# EAGLE design AT42QT2120-breakout (EAGLE 9.2.2)
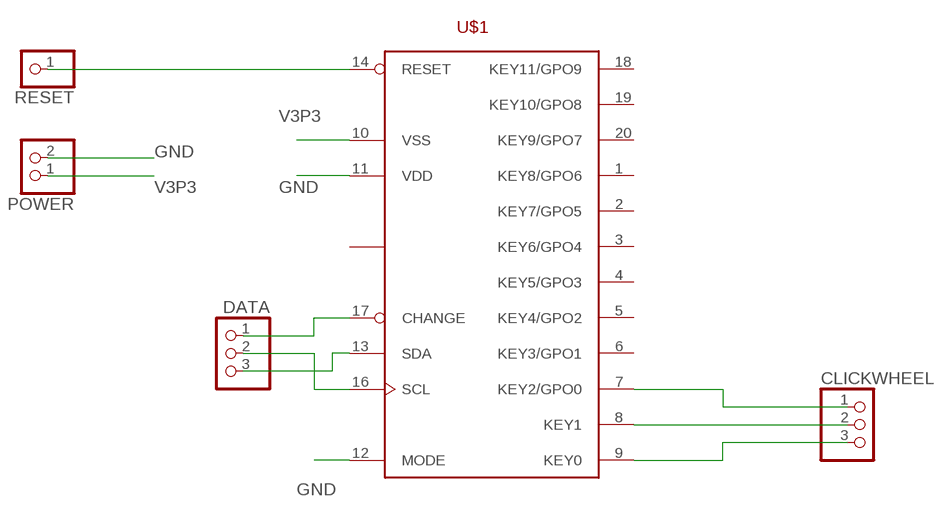
[diagram p0: schematic, sheet 1]

## Parts
CLICKWHEEL  PINHD-1X3/90  [1X03/90]
DATA  PINHD-1X3/90  [1X03/90]
POWER  PINHD-1X2/90  [1X02/90]
RESET  PINHD-1X1  [1X01]
U$1  COMMS-AT42QT2120SU  [SO20W]

## Nets
GND: POWER.2 U$1.11(VDD) U$1.12(MODE)
N$1: RESET.1 U$1.14(RESET)
N$2: DATA.1 U$1.17(CHANGE)
N$4: DATA.2 U$1.16(SCL)
N$5: CLICKWHEEL.3 U$1.9(KEY0)
N$6: CLICKWHEEL.2 U$1.8(KEY1)
N$7: CLICKWHEEL.1 U$1.7(KEY2/GPO0)
N$8: DATA.3 U$1.13(SDA)
V3P3: POWER.1 U$1.10(VSS)
Unconnected: U$1.1(KEY8/GPO6) U$1.2(KEY7/GPO5) U$1.3(KEY6/GPO4) U$1.4(KEY5/GPO3) U$1.5(KEY4/GPO2) U$1.6(KEY3/GPO1) U$1.15(NC) U$1.18(KEY11/GPO9) U$1.19(KEY10/GPO8) U$1.20(KEY9/GPO7)

## Library data of the parts
CLICKWHEEL DATA = pinhead:PINHD-1X3: PIN HEADER
POWER = pinhead:PINHD-1X2: PIN HEADER
RESET = pinhead:PINHD-1X1: PIN HEADER
U$1 = AT42QT2120:COMMS-AT42QT2120

## Board
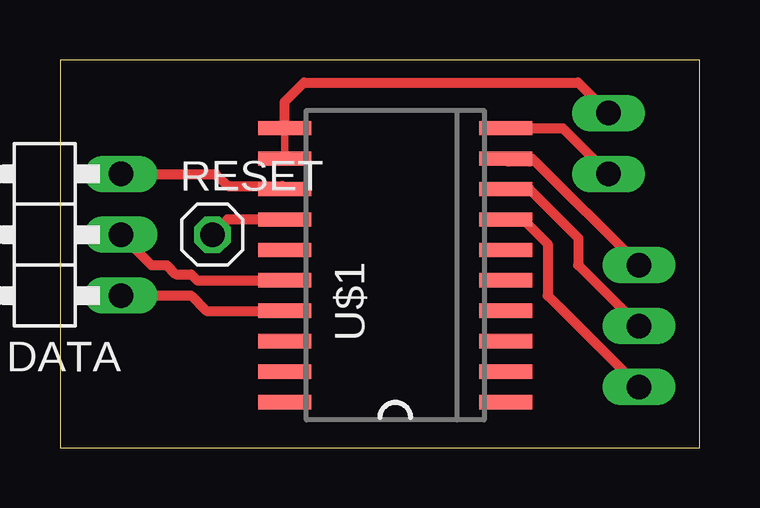
[diagram p1: board, top side]
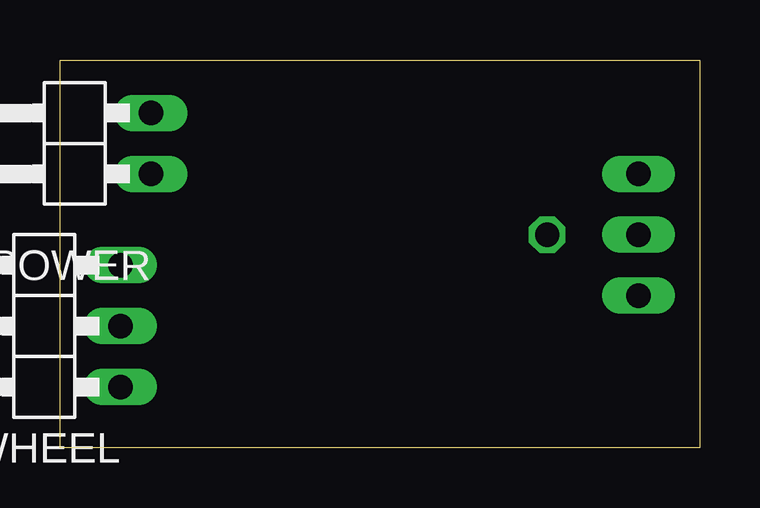
[diagram p2: board, bottom side, seen from below]

Size 26.65 x 16.18 mm. Coordinates in mm from the lower left corner, seen from the top.
Outline: 0,0 26.65,0 26.65,16.18 0,16.18 0,0
Copper layers (1*16): Top 0.035mm / dielectric 1.5mm / Bottom 0.035mm
Design rules "default": minimum track width 6mil, minimum drill 0.35mm, track to track 6mil, track to pad 6mil, pad to pad 6mil, via to via 6mil, smd to smd 6mil, copper to edge 40mil, drill to drill 6mil, minimum pad ring 10mil, minimum via ring 8mil, stop-mask expansion 4mil, vias tented up to drill 0mil, thermal gap 10mil

### Footprints (pad centres in the part's own frame; a part is rotated, then mirrored left to right if it is on the bottom)
1X03/90 = drill 1.016 long: 1 -2.54,-3.81; 2 0,-3.81; 3 2.54,-3.81
1X02/90 = drill 1.016 long: 1 -1.27,-3.81; 2 1.27,-3.81
1X01 = drill 1.016 octagon: 1 0,0
SO20W = smd 0.6 x 2.2: 1 -5.715,-4.6; 2 -4.445,-4.6; 3 -3.175,-4.6; 4 -1.905,-4.6; 5 -0.635,-4.6; 6 0.635,-4.6; 7 1.905,-4.6; 8 3.175,-4.6; 9 4.445,-4.6; 10 5.715,-4.6; 11 5.715,4.6; 12 4.445,4.6; 13 3.175,4.6; 14 1.905,4.6; 15 0.635,4.6; 16 -0.635,4.6; 17 -1.905,4.6; 18 -3.175,4.6; 19 -4.445,4.6; 20 -5.715,4.6

### Placement (x,y rotation side)
CLICKWHEEL  27.94,5.08 90 bottom
DATA  -1.27,8.89 90 top
POWER  26.67,12.7 90 bottom
RESET  6.35,8.89 0 top
U$1  13.97,7.62 90 top

### Tracks (layer width: path | path; a pad name or v marks a point on that pad's centre or on a via)
GND
  Top 0.305: U$1.12 U$1.11
  Top 0.406: U$1.11 9.37,14.45 10.16,15.24 21.59,15.24 POWER.2
N$1
  Top 0.406: U$1.14 6.98,9.53 RESET.1
N$2
  Top 0.406: U$1.17 6.1,5.71 5.46,6.35 DATA.1
N$4
  Top 0.406: DATA.2 3.81,7.62 4.45,7.62 4.83,7.24 5.46,7.24 5.71,6.98 U$1.16
N$5
  Top 0.406: 19.56,11.94 18.7,11.94 U$1.9 19.69,12.07 CLICKWHEEL.3
N$6
  Top 0.406: U$1.8 19.56,10.8 21.59,8.76 21.59,7.62 CLICKWHEEL.2
N$7
  Top 0.406: U$1.7 19.3,9.53 20.32,8.51 20.32,6.35 CLICKWHEEL.1
N$8
  Top 0.406: DATA.3 6.48,11.43 6.98,10.92 9.24,10.92 U$1.13
V3P3
  Top 0.305: 19.69,13.34 U$1.10
  Top 0.406: U$1.10 20.95,13.34 POWER.1